# Altium schematic sheet Etapa_Regulacion.SchDoc
size A3
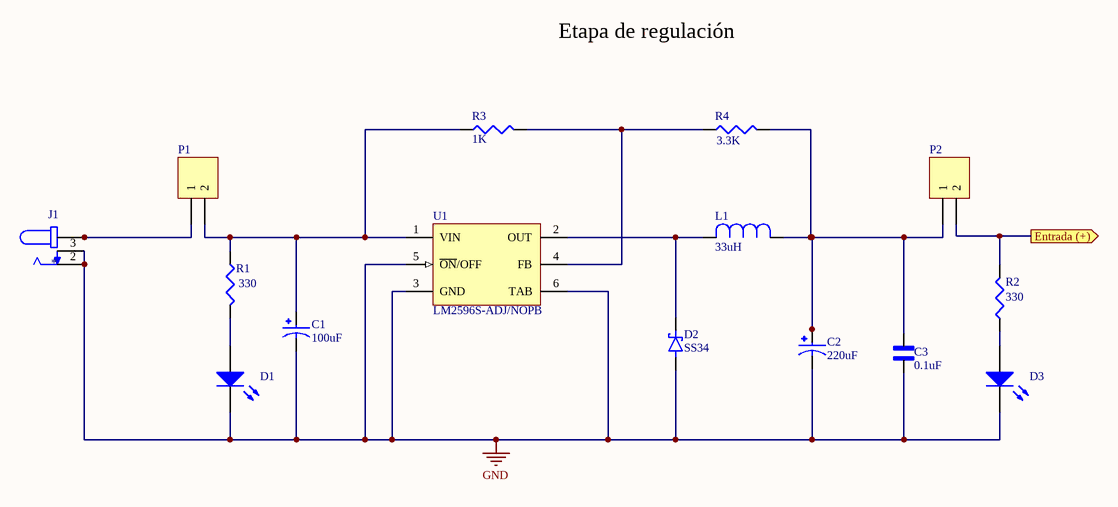
[diagram p0: Etapa_Regulacion.SchDoc]

## Parts
C1  100uF  [CAP_16SVPG220M]
C2  220uF  [CAP_16SVPG220M]
C3  0.1uF  [CAPC4632X221N]
D1  LED2  [3.2X1.6X1.1]  (value not drawn)
D2  SS34  [DIOM7959X265N]
D3  LED2  [3.2X1.6X1.1]  (value not drawn)
J1  *  [CUI_PJ-002BH-SMT-TR]
L1  33uH  [IND_CDRH127/LDNP-470MC_SUM]
P1  Header 2  [HDR1X2]  (value not drawn)
P2  Header 2  [HDR1X2]  (value not drawn)
R1  value 330  [J1-0805]  (hidden comment: Res3)
R2  value 330  [J1-0805]  (hidden comment: Res3)
R3  value 1K  [J1-0805]  (hidden comment: Res3)
R4  value 3.3K  [J1-0805]  (hidden comment: Res3)
U1  LM2596S-ADJ/NOPB  [KTT0005B_N]

## Ports
Entrada (+) (out)

## Nets
GND: C1.2 C2.2 C3.1 D1.2(K) D2.1(A) D3.2(K) J1.2 J1.3 U1.3(GND) U1.5(~{ON}/OFF) U1.6(TAB)
Entrada (+): P2.2 R2.2 ; port Entrada (+)
NetC1_1: C1.1 P1.2 R1.1 R3.1 U1.1(VIN)
NetC2_1: C2.1 C3.2 L1.1 P2.1 R4.2
NetD1_1: D1.1(A) R1.2
NetD2_2: D2.2(K) L1.2 U1.2(OUT)
NetD3_1: D3.1(A) R2.1
NetJ1_1A: J1.1A J1.1B P1.1
NetR3_2: R3.2 R4.1 U1.4(FB)

## Notes on the sheet
- Etapa de regulación

## Library data of the parts
C1 C2 = 16SVPG220M: MP: 16SVPG220M; Price: None; Package: None; Value: *; Availability: Unavailable
C3 = 1812CC104KAZ1A: CAP,CERM,0.10UF,630V,X7R,1812; Dielectric Characteristic:X7R; Capacitance:100nF; Capacitance Tolerance:Â± 10%; Voltage Rating:630V; Temperature Coefficient:Â± 15%; Series:LT; Capacitor Case Style:1812; No. of Pins:2; Mounting Type:SMD; Operating Temperature Range:-55Â°C to +125Â°C; SVHC:No SVHC (18-Jun-2010); Package: None; Price: None; Value: *; MP: 1812CC104KAZ1A; Availability: Unavailable
D1 D3 = LED2: Typical RED, GREEN, YELLOW, AMBER GaAs LED; Published: 8-Jun-2000; LatestRevisionDate: 17-Jul-2002; LatestRevisionNote: Re-released for DXP Platform.; PackageVersion: Feb-2002; PackageReference: 3.2X1.6X1.1; Publisher: Altium Limited; PackageDescription: SM LED; 2 Flat Leads
D2 = SS34: Diode Schottky 40V 3A Surface Mount SMC _DO-214AB_; MF: ON Semiconductor; SnapEDA_Link: https://www.snapeda.com/parts/SS34/ON%20Semiconductor/view-part/4631325/?ref=snap; MP: SS34; Availability: Unavailable; Price: None; Value: *; Package: DO-214AB-214 ON Semiconductor
J1 = PJ-002BH-SMT-TR: 2.5 x 6.5 mm, 5.0 A, Horizontal, Surface Mount _SMT_, Dc Power Jack Connector; MF: CUI Devices; Package: None; CUI_purchase_URL: https://www.cuidevices.com/product/interconnect/connectors/dc-power-connectors/jacks/pj-002bh-smt-tr?utm_source=snapeda.com&utm_medium=referral&utm_campaign=snapedaBOM; Value: *; Price: None; MP: PJ-002BH-SMT-TR; SnapEDA_Link: https://www.snapeda.com/parts/PJ-002BH-SMT-TR/CUI%20Devices/view-part/378040/?ref=snap; Availability: Unavailable
L1 = CDRH127/LDNP-470MC: 47ÂµH Shielded Inductor 3.25A 78mOhm Max Nonstandard; MF: Sumida America; Digi-Key_Part_Number: 308-1339-1-ND; Check_prices: https://www.snapeda.com/parts/CDRH127/LDNP-470MC/Sumida%20America%20Components%20Inc./view-part/547921/?ref=eda; Package: Nonstandard Sumida; Value: *; MP: CDRH127/LDNP-470MC; SnapEDA_Link: https://www.snapeda.com/parts/CDRH127/LDNP-470MC/Sumida%20America%20Components%20Inc./view-part/547921/?ref=snap; Purchase-URL: https://pricing.snapeda.com/search/part/CDRH127/LDNP-470MC/?ref=eda
P1 P2 = Header 2: Header, 2-Pin; LatestRevisionDate: 17-Jul-2002; LatestRevisionNote: Re-released for DXP Platform.; Publisher: Altium Limited
R1-R4 = Res3: Resistor; Published: 8-Jun-2000; LatestRevisionDate: 29-May-2009; LatestRevisionNote: IPC-7351 Footprint Added.; PackageReference: J1-0603; Publisher: Altium Limited; PackageDescription: Chip Resistor
U1 = CMP-0069-00271-3: SIMPLE SWITCHER® Power Converter 150 KHz 3A Step-Down Voltage Regulator, 5-pin TO-263, Pb-Free; Manufacturer: Texas Instruments; PowerWise: N; PackageTopMarking: NSUZXYTTE#*LM2596S*-ADJ P+; ComponentLink1Description: Datasheet URL; PackageDescription: TO-263, Molded, .400 x .390 x .180in, 5 Lead, .067in Pitch, Surface Mount; ComponentLink1URL: http://www.ti.com/general/docs/lit/getliterature.tsp?genericPartNumber=LM2596&fileType=pdf; Code_JEDEC: MO-169-AB; PinCount: 5; CompType: Switcher; PackageReference: KTT0005B; RoHS: Y